# EAGLE schematic Low_Pass_Filter (EAGLE 8.4.1)
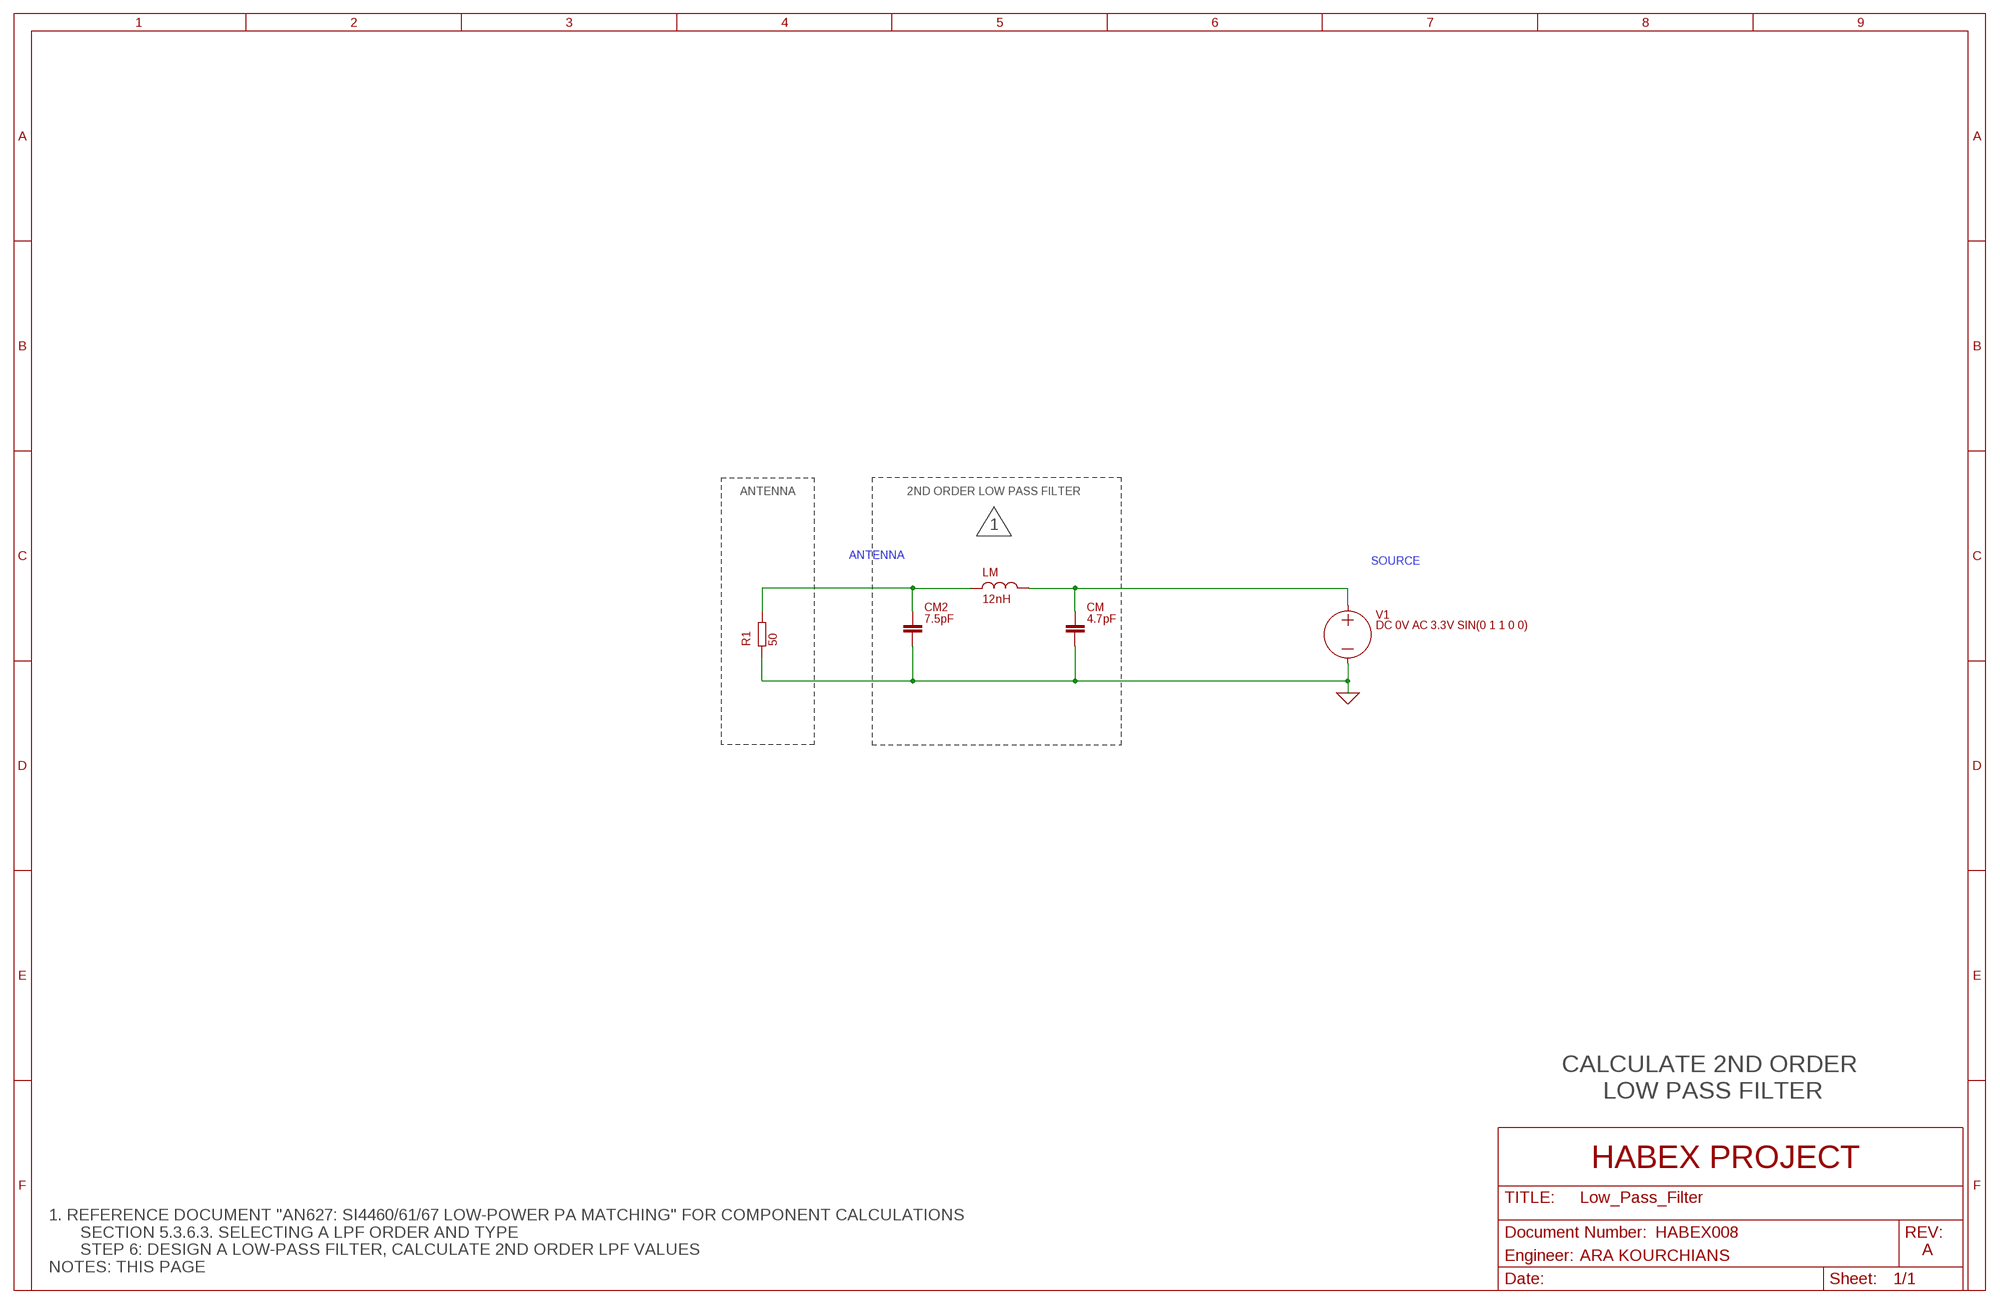
[diagram p0: schematic, sheet 1]

## Parts
CM  4.7pF  C  (no package)
CM2  7.5pF  C  (no package)
LM  12nH  L  (no package)
R1  50  R  (no package)
V1  DC 0V AC 3.3V SIN(0 1 1 0 0)  VOLTAGE  (no package)

## Nets
0: CM2.2 CM.2 R1.1 V1.- ; supply symbol labelled GND
ANTENNA: CM2.1 LM.1 R1.2
SOURCE: CM.1 LM.2 V1.+

## Notes on the sheet
- ANTENNA | 2ND ORDER LOW PASS FILTER
- 1
- CALCULATE 2ND ORDER 
  LOW PASS FILTER
- HABEX PROJECT
- HABEX008
- A
- Engineer: | ARA KOURCHIANS
- 1. REFERENCE DOCUMENT "AN627: SI4460/61/67 LOW-POWER PA MATCHING" FOR COMPONENT CALCULATIONS
         SECTION 5.3.6.3. SELECTING A LPF ORDER AND TYPE
         STEP 6: DESIGN A LOW-PASS FILTER, CALCULATE 2ND ORDER LPF VALUES
  NOTES: THIS PAGE

## Library data of the parts
CM CM2 = ngspice-simulation:C: CAPACITOR
LM = ngspice-simulation:L: INDUCTOR
R1 = ngspice-simulation:R: RESISTOR
V1 = ngspice-simulation:VOLTAGE: Independent Voltage Source, either DC, AC, PULSE, SINE, PWL, EXP, or SFFM; VALUE: 0V